# Altium schematic sheet InPut.SchDoc
size A
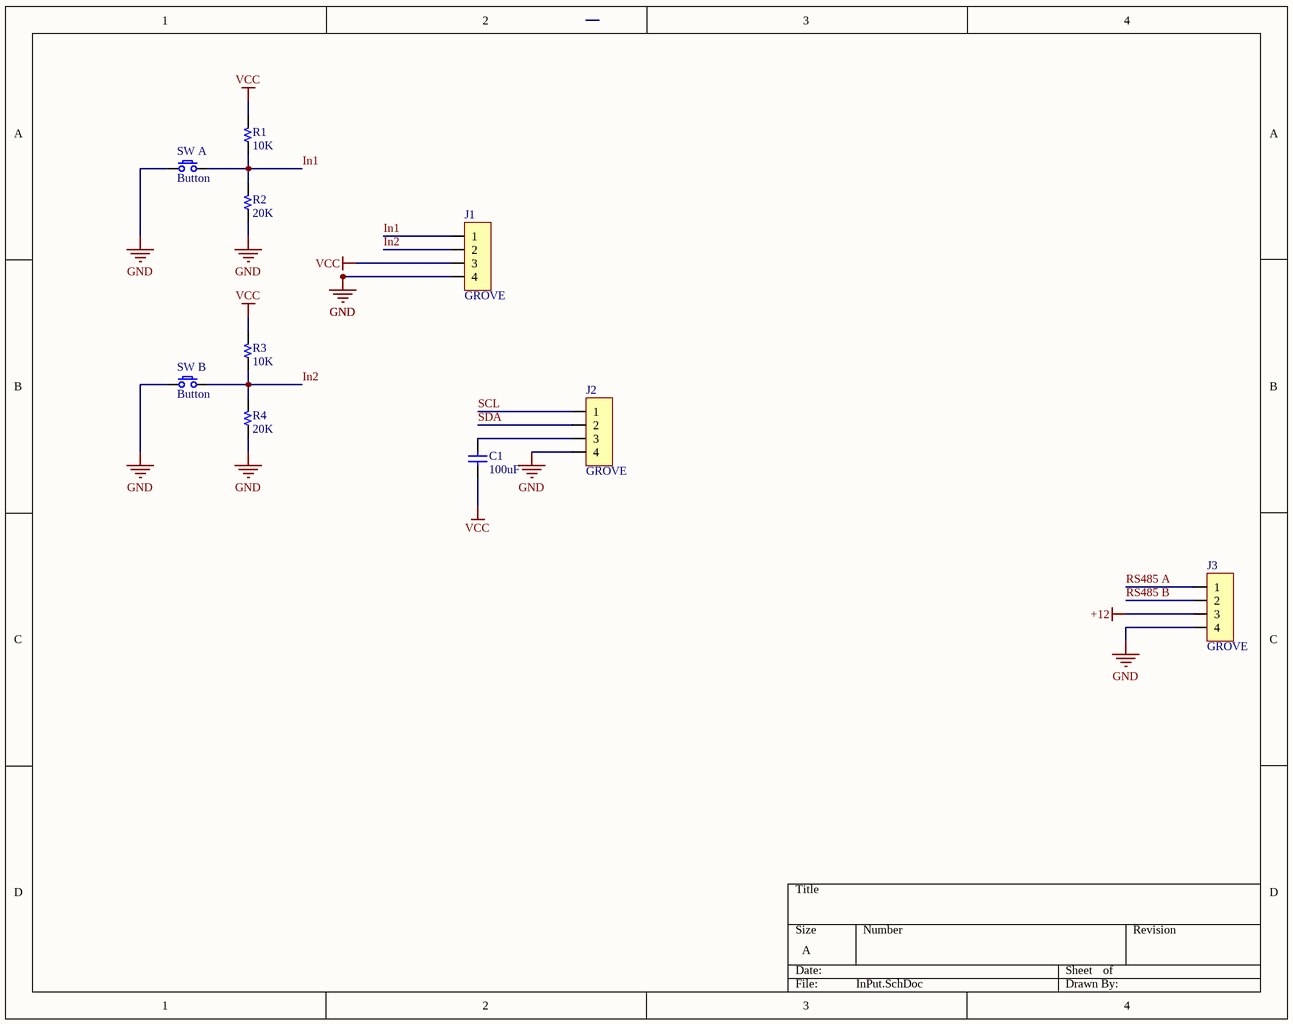
[diagram p0: InPut.SchDoc]

## Parts
C1  100uF  [C 0805]
J1  GROVE  [HDR/Header/4/BOX/SMD]
J2  GROVE  [HDR/Header/4/BOX/SMD]
J3  GROVE  [HDR/Header/4/BOX/SMD]
R1  10K  [R 0805]
R2  20K  [R 0805]
R3  10K  [R 0805]
R4  20K  [R 0805]
SW_A  Button  [SW/2/DIP]
SW_B  Button  [SW/2/DIP]

## Nets
+12: J3.3
GND: J1.4 J2.4 J3.4 R2.1 R4.1 SW_A.1 SW_B.1
VCC: C1.2 J1.3 R1.2 R3.2
In1: J1.1 R1.1 R2.2 SW_A.2
In2: J1.2 R3.1 R4.2 SW_B.2
RS485 A: J3.1
RS485 B: J3.2
SCL: J2.1
SDA: J2.2
NetC1_1: C1.1 J2.3

## Library data of the parts
C1 = Capacitor NP: Capacitor non-pol
J1-J3 = Header 4: Header, 4-Pin
R1-R4 = Resistor
SW_A SW_B = SW SPST: Tact switch 2 pin